# EAGLE design VierGewinnt010 (EAGLE 7.5.0)
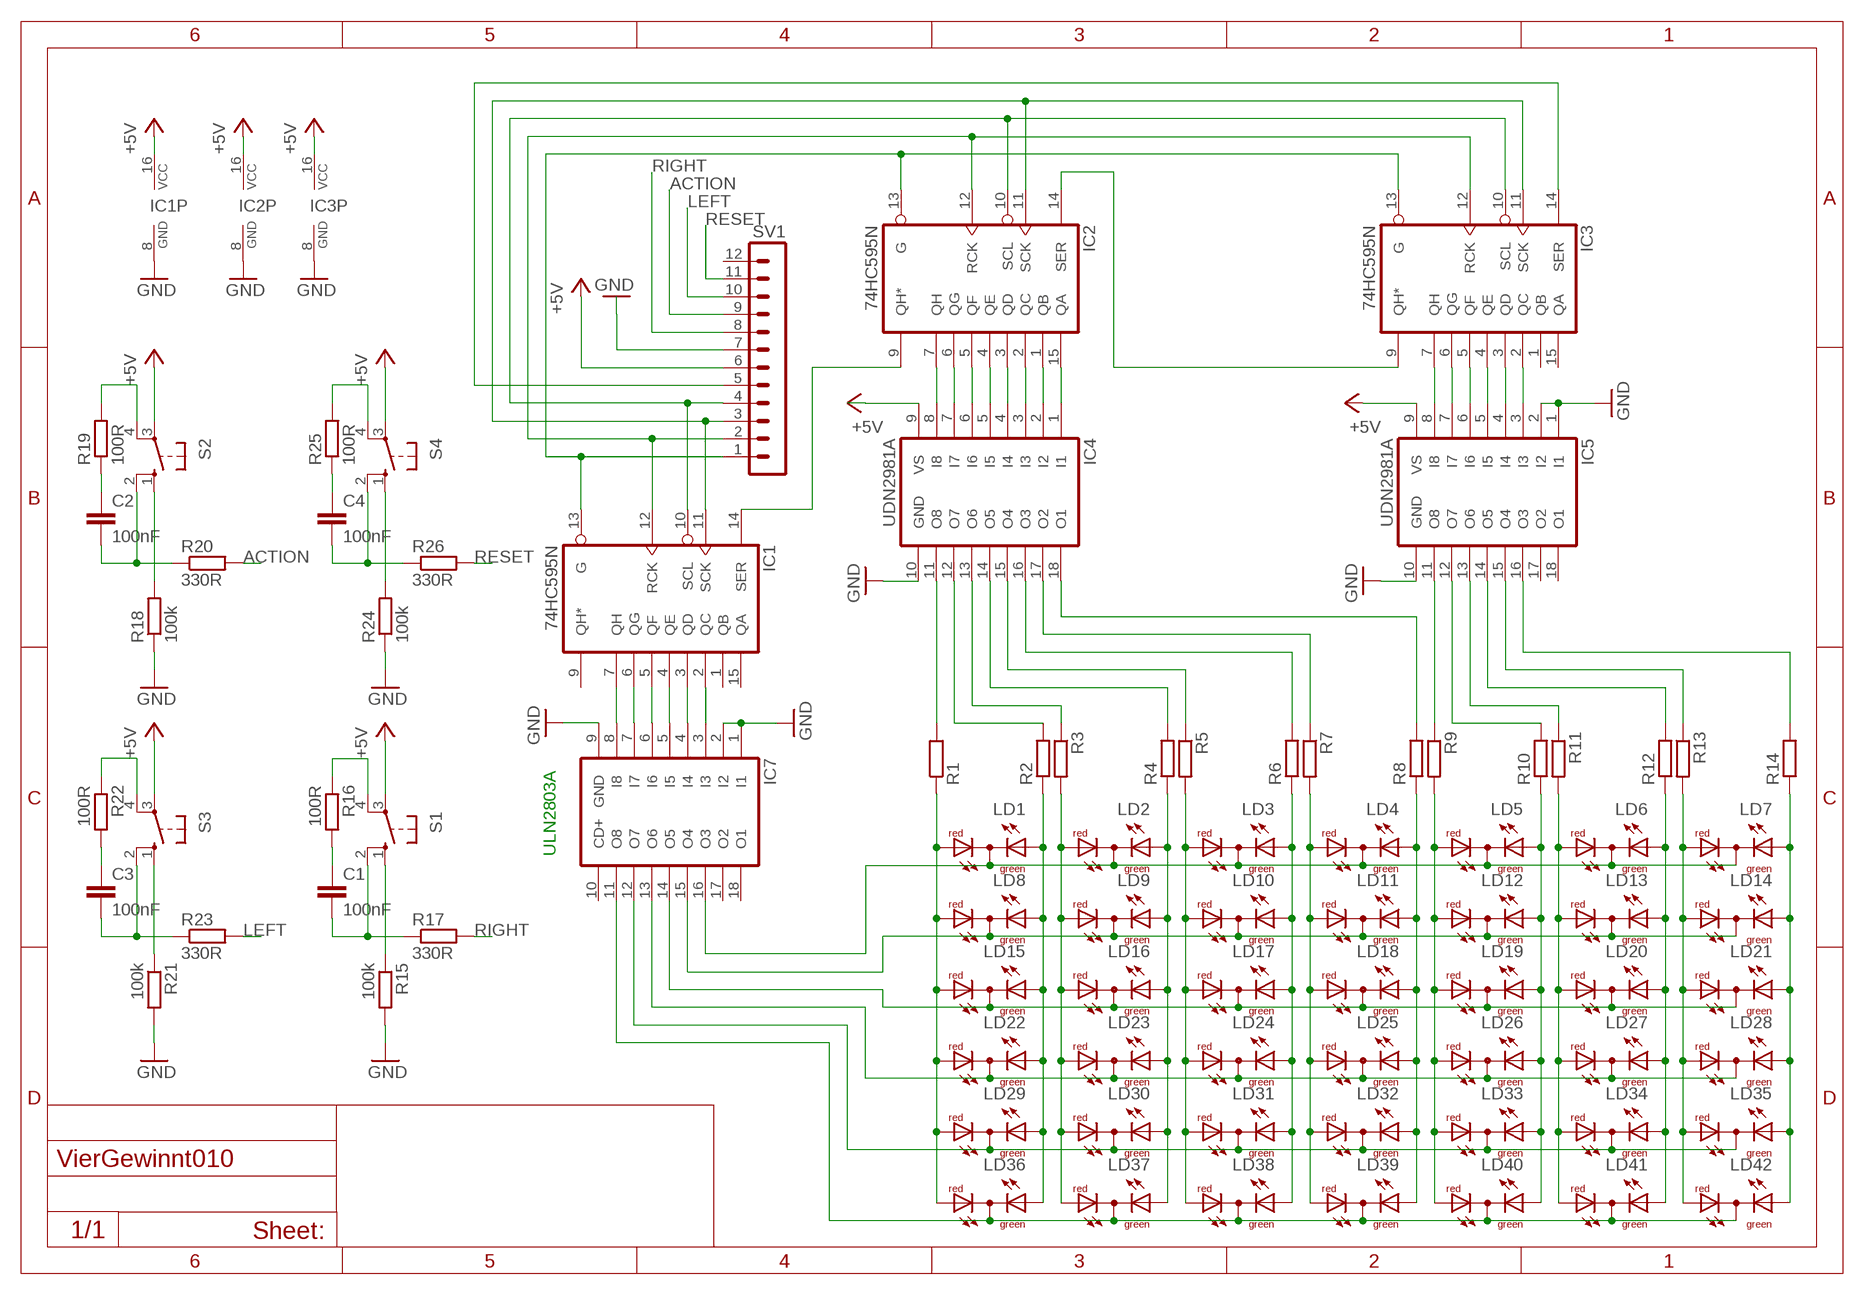
[diagram p0: schematic, sheet 1]

## Parts
C1  100nF  C-EUC0805  [C0805]
C2  100nF  C-EUC0805  [C0805]
C3  100nF  C-EUC0805  [C0805]
C4  100nF  C-EUC0805  [C0805]
IC1  74HC595N  [DIL16]
IC2  74HC595N  [DIL16]
IC3  74HC595N  [DIL16]
IC4  UDN2981A  [DIL18]
IC5  UDN2981A  [DIL18]
IC7  ULN2803A  [DIL18]
LD1  DUOLED-RG-C  [DUOLED-C-5MM]
LD2  DUOLED-RG-C  [DUOLED-C-5MM]
LD3  DUOLED-RG-C  [DUOLED-C-5MM]
LD4  DUOLED-RG-C  [DUOLED-C-5MM]
LD5  DUOLED-RG-C  [DUOLED-C-5MM]
LD6  DUOLED-RG-C  [DUOLED-C-5MM]
LD7  DUOLED-RG-C  [DUOLED-C-5MM]
LD8  DUOLED-RG-C  [DUOLED-C-5MM]
LD9  DUOLED-RG-C  [DUOLED-C-5MM]
LD10  DUOLED-RG-C  [DUOLED-C-5MM]
LD11  DUOLED-RG-C  [DUOLED-C-5MM]
LD12  DUOLED-RG-C  [DUOLED-C-5MM]
LD13  DUOLED-RG-C  [DUOLED-C-5MM]
LD14  DUOLED-RG-C  [DUOLED-C-5MM]
LD15  DUOLED-RG-C  [DUOLED-C-5MM]
LD16  DUOLED-RG-C  [DUOLED-C-5MM]
LD17  DUOLED-RG-C  [DUOLED-C-5MM]
LD18  DUOLED-RG-C  [DUOLED-C-5MM]
LD19  DUOLED-RG-C  [DUOLED-C-5MM]
LD20  DUOLED-RG-C  [DUOLED-C-5MM]
LD21  DUOLED-RG-C  [DUOLED-C-5MM]
LD22  DUOLED-RG-C  [DUOLED-C-5MM]
LD23  DUOLED-RG-C  [DUOLED-C-5MM]
LD24  DUOLED-RG-C  [DUOLED-C-5MM]
LD25  DUOLED-RG-C  [DUOLED-C-5MM]
LD26  DUOLED-RG-C  [DUOLED-C-5MM]
LD27  DUOLED-RG-C  [DUOLED-C-5MM]
LD28  DUOLED-RG-C  [DUOLED-C-5MM]
LD29  DUOLED-RG-C  [DUOLED-C-5MM]
LD30  DUOLED-RG-C  [DUOLED-C-5MM]
LD31  DUOLED-RG-C  [DUOLED-C-5MM]
LD32  DUOLED-RG-C  [DUOLED-C-5MM]
LD33  DUOLED-RG-C  [DUOLED-C-5MM]
LD34  DUOLED-RG-C  [DUOLED-C-5MM]
LD35  DUOLED-RG-C  [DUOLED-C-5MM]
LD36  DUOLED-RG-C  [DUOLED-C-5MM]
LD37  DUOLED-RG-C  [DUOLED-C-5MM]
LD38  DUOLED-RG-C  [DUOLED-C-5MM]
LD39  DUOLED-RG-C  [DUOLED-C-5MM]
LD40  DUOLED-RG-C  [DUOLED-C-5MM]
LD41  DUOLED-RG-C  [DUOLED-C-5MM]
LD42  DUOLED-RG-C  [DUOLED-C-5MM]
R1  R-EU_0207/10  [0207/10]
R2  R-EU_0207/10  [0207/10]
R3  R-EU_0207/10  [0207/10]
R4  R-EU_0207/10  [0207/10]
R5  R-EU_0207/10  [0207/10]
R6  R-EU_0207/10  [0207/10]
R7  R-EU_0207/10  [0207/10]
R8  R-EU_0207/10  [0207/10]
R9  R-EU_0207/10  [0207/10]
R10  R-EU_0207/10  [0207/10]
R11  R-EU_0207/10  [0207/10]
R12  R-EU_0207/10  [0207/10]
R13  R-EU_0207/10  [0207/10]
R14  R-EU_0207/10  [0207/10]
R15  100k  R-EU_R0603  [R0603]
R16  100R  R-EU_R0603  [R0603]
R17  330R  R-EU_R0603  [R0603]
R18  100k  R-EU_R0603  [R0603]
R19  100R  R-EU_R0603  [R0603]
R20  330R  R-EU_R0603  [R0603]
R21  100k  R-EU_R0603  [R0603]
R22  100R  R-EU_R0603  [R0603]
R23  330R  R-EU_R0603  [R0603]
R24  100k  R-EU_R0603  [R0603]
R25  100R  R-EU_R0603  [R0603]
R26  330R  R-EU_R0603  [R0603]
S1  10-XX  [B3F-10XX]
S2  10-XX  [B3F-10XX]
S3  10-XX  [B3F-10XX]
S4  10-XX  [B3F-10XX]
SV1  MA12-1  [MA12-1]

## Nets
+5V: IC1.16(VCC) IC2.16(VCC) IC3.16(VCC) IC4.9(VS) IC5.9(VS) S1.3(P) S2.3(P) S3.3(P) S4.3(P) SV1.6
ACTION: R20.2 SV1.9
GND: IC1.8(GND) IC2.8(GND) IC3.8(GND) IC4.10(GND) IC5.1(I1) IC5.2(I2) IC5.10(GND) IC7.1(I1) IC7.2(I2) IC7.9(GND) R15.2 R18.1 R21.2 R24.1 SV1.7
LEFT: R23.2 SV1.10
N$1: LD1.AR LD8.AR LD15.AR LD22.AR LD29.AR LD36.AR R1.1
N$2: LD1.AX(AG) LD8.AX(AG) LD15.AX(AG) LD22.AX(AG) LD29.AX(AG) LD36.AX(AG) R2.1
N$3: LD2.AR LD9.AR LD16.AR LD23.AR LD30.AR LD37.AR R3.2
N$4: LD2.AX(AG) LD9.AX(AG) LD16.AX(AG) LD23.AX(AG) LD30.AX(AG) LD37.AX(AG) R4.1
N$5: LD3.AR LD10.AR LD17.AR LD24.AR LD31.AR LD38.AR R5.2
N$6: LD3.AX(AG) LD10.AX(AG) LD17.AX(AG) LD24.AX(AG) LD31.AX(AG) LD38.AX(AG) R6.1
N$7: LD4.AR LD11.AR LD18.AR LD25.AR LD32.AR LD39.AR R7.2
N$8: LD4.AX(AG) LD11.AX(AG) LD18.AX(AG) LD25.AX(AG) LD32.AX(AG) LD39.AX(AG) R8.1
N$9: LD5.AR LD12.AR LD19.AR LD26.AR LD33.AR LD40.AR R9.2
N$10: LD5.AX(AG) LD12.AX(AG) LD19.AX(AG) LD26.AX(AG) LD33.AX(AG) LD40.AX(AG) R10.1
N$11: LD6.AR LD13.AR LD20.AR LD27.AR LD34.AR LD41.AR R11.2
N$12: LD6.AX(AG) LD13.AX(AG) LD20.AX(AG) LD27.AX(AG) LD34.AX(AG) LD41.AX(AG) R12.1
N$13: LD7.AR LD14.AR LD21.AR LD28.AR LD35.AR LD42.AR R13.2
N$14: LD7.AX(AG) LD14.AX(AG) LD21.AX(AG) LD28.AX(AG) LD35.AX(AG) LD42.AX(AG) R14.1
N$15: IC7.16(O3) LD1.C LD2.C LD3.C LD4.C LD5.C LD6.C LD7.C
N$17: IC7.14(O5) LD15.C LD16.C LD17.C LD18.C LD19.C LD20.C LD21.C
N$18: IC7.13(O6) LD22.C LD23.C LD24.C LD25.C LD26.C LD27.C LD28.C
N$19: IC7.12(O7) LD29.C LD30.C LD31.C LD32.C LD33.C LD34.C LD35.C
N$20: IC7.11(O8) LD36.C LD37.C LD38.C LD39.C LD40.C LD41.C LD42.C
N$21: IC4.11(O8) R1.2
N$22: IC4.12(O7) R2.2
N$23: IC4.13(O6) R3.1
N$24: IC4.14(O5) R4.2
N$25: IC4.15(O4) R5.1
N$26: IC4.16(O3) R6.2
N$27: IC4.17(O2) R7.1
N$28: IC4.18(O1) R8.2
N$29: IC5.11(O8) R9.1
N$30: IC5.12(O7) R10.2
N$31: IC5.13(O6) R11.1
N$32: IC5.14(O5) R12.2
N$33: IC5.15(O4) R13.1
N$34: IC5.16(O3) R14.2
N$35: IC2.1(QB) IC4.2(I2)
N$36: IC2.2(QC) IC4.3(I3)
N$37: IC2.3(QD) IC4.4(I4)
N$38: IC2.4(QE) IC4.5(I5)
N$39: IC2.5(QF) IC4.6(I6)
N$40: IC2.6(QG) IC4.7(I7)
N$41: IC2.7(QH) IC4.8(I8)
N$42: IC2.15(QA) IC4.1(I1)
N$43: R22.1 S3.4(P1)
N$44: IC3.2(QC) IC5.3(I3)
N$45: IC3.3(QD) IC5.4(I4)
N$46: IC3.4(QE) IC5.5(I5)
N$47: IC3.5(QF) IC5.6(I6)
N$48: IC3.6(QG) IC5.7(I7)
N$49: IC3.7(QH) IC5.8(I8)
N$50: C1.1 R16.2
N$51: IC2.14(SER) IC3.9(QH*)
N$52: IC1.14(SER) IC2.9(QH*)
N$53: IC1.13(G) IC2.13(G) IC3.13(G) SV1.1
N$54: IC1.12(RCK) IC2.12(RCK) IC3.12(RCK) SV1.2
N$55: IC1.10(SCL) IC2.10(SCL) IC3.10(SCL) SV1.4
N$56: IC1.11(SCK) IC2.11(SCK) IC3.11(SCK) SV1.3
N$57: IC3.14(SER) SV1.5
N$58: R18.2 S2.1(S)
N$59: R19.2 S2.4(P1)
N$60: C1.2 R17.1 S1.2(S1)
N$61: R16.1 S1.4(P1)
N$62: C3.2 R23.1 S3.2(S1)
N$63: C2.2 R20.1 S2.2(S1)
N$64: R21.1 S3.1(S)
N$65: R15.1 S1.1(S)
N$66: C4.1 R25.1
N$67: R25.2 S4.4(P1)
N$68: C2.1 R19.1
N$69: C4.2 R26.1 S4.2(S1)
N$70: C3.1 R22.2
N$71: R24.2 S4.1(S)
N$74: IC1.2(QC) IC7.3(I3)
N$75: IC1.3(QD) IC7.4(I4)
N$76: IC1.4(QE) IC7.5(I5)
N$77: IC1.5(QF) IC7.6(I6)
N$78: IC1.6(QG) IC7.7(I7)
N$79: IC1.7(QH) IC7.8(I8)
N$80: IC7.15(O4) LD8.C LD9.C LD10.C LD11.C LD12.C LD13.C LD14.C
RESET: R26.2 SV1.11
RIGHT: R17.2 SV1.8
Unconnected: IC1.1(QB) IC1.9(QH*) IC1.15(QA) IC3.1(QB) IC3.15(QA) IC5.17(O2) IC5.18(O1) IC7.10(CD+) IC7.17(O2) IC7.18(O1) SV1.12

## Notes on the sheet
- ULN2803A

## Library data of the parts
C1-C4 = rcl:C-EU: CAPACITOR, European symbol
IC1-IC3 = 74xx-eu:74*595: 8-bit SHIFT REGISTER, output latch
IC4 IC5 = uln-udn:UDN298*: DRIVER ARRAY Source: Allegro Microsystems Inc. / UDN2981-UDN2984.pdf
IC7 = uln-udn:ULN2803A: DRIVER ARRAY
LD1-LD42 = led:DUOLED-RG-C: DUO LED 2 colors (red/green), 5 mm, round, common Cathode www.ligitek.com or other producers.
R1-R26 = rcl:R-EU_: RESISTOR, European symbol
S1-S4 = switch-omron:10-XX: OMRON SWITCH
SV1 = con-lstb:MA12-1: PIN HEADER

## Board
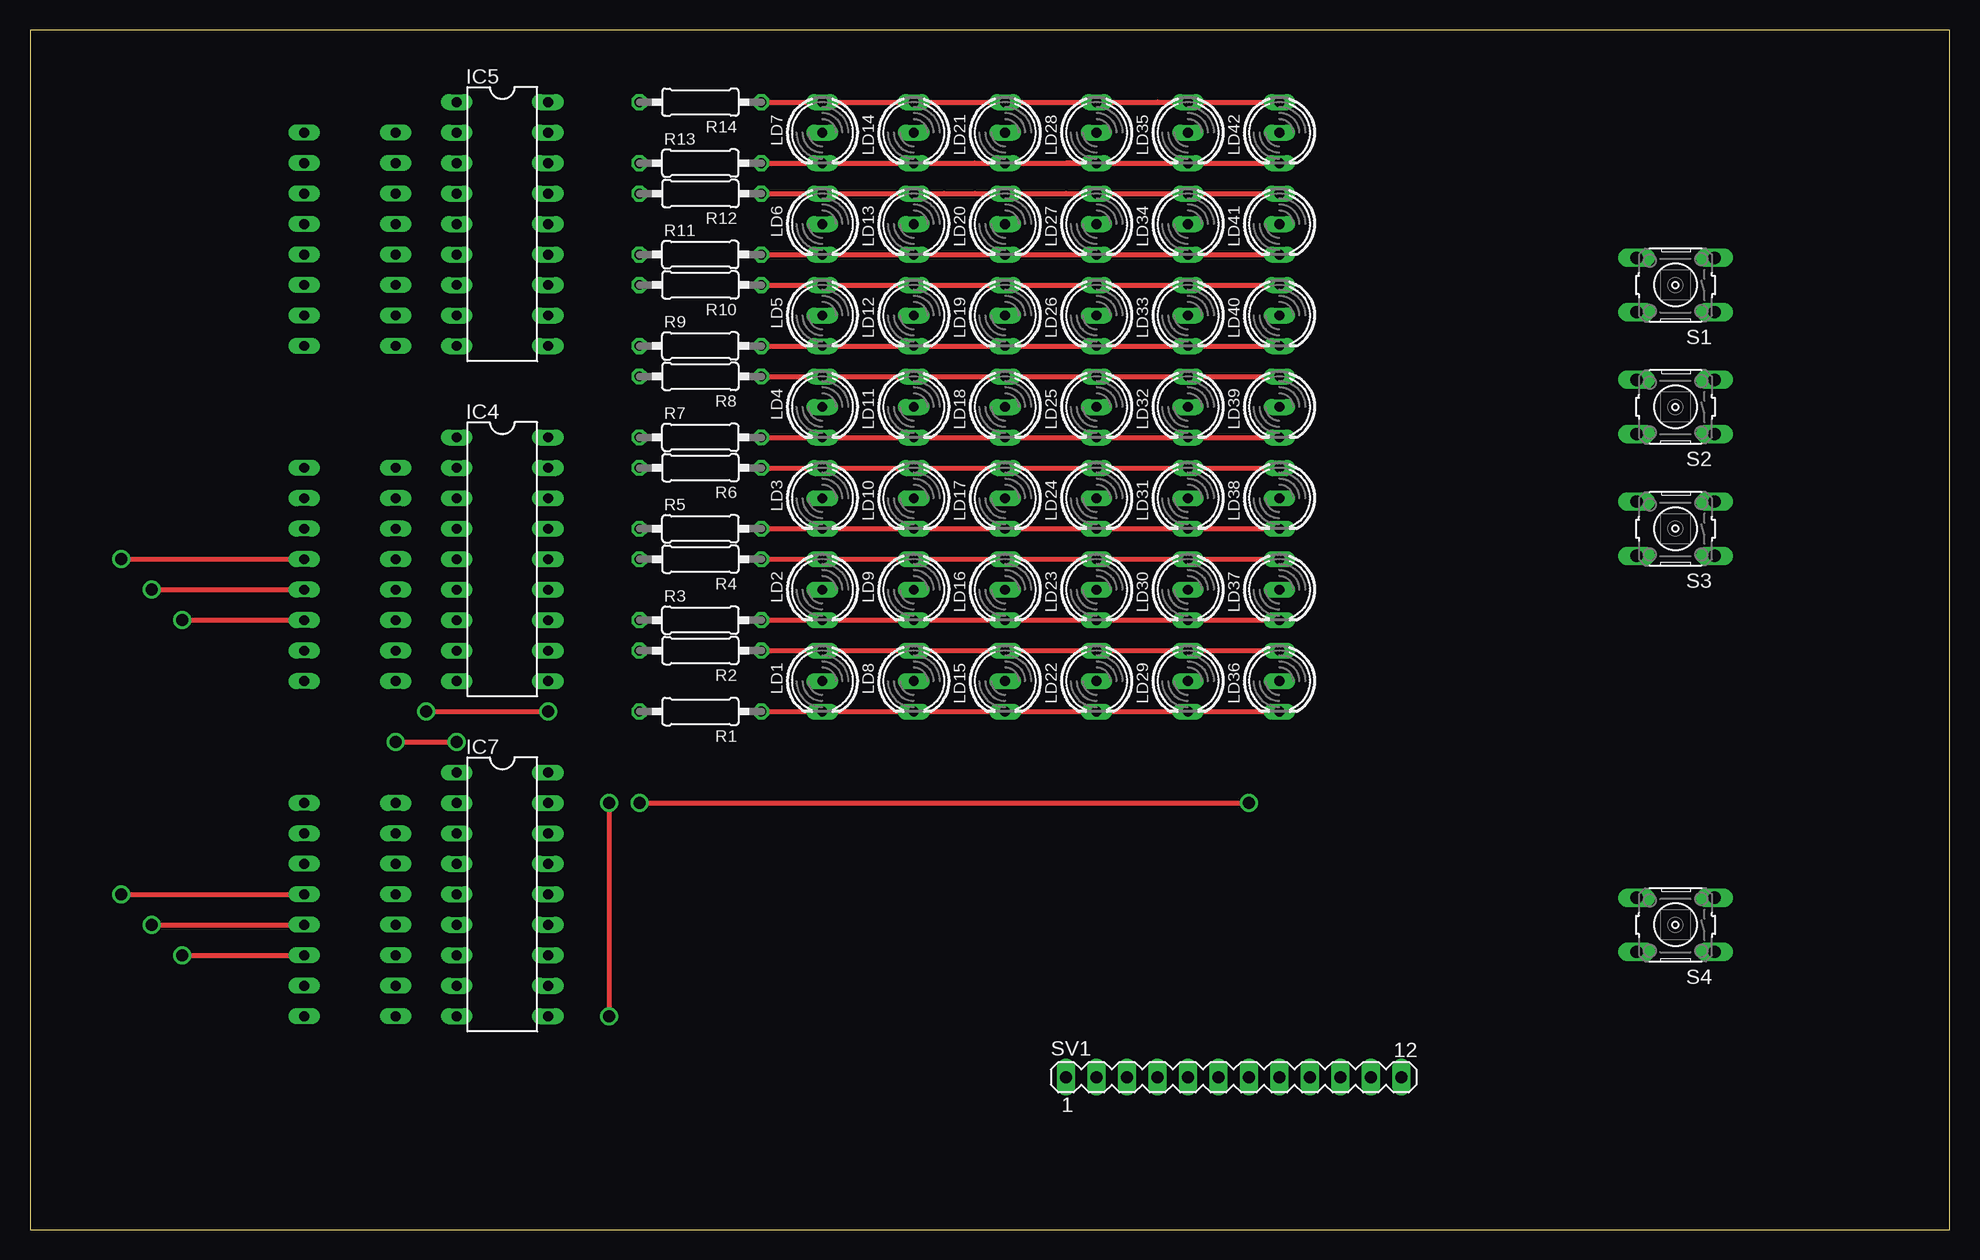
[diagram p1: board, top side]
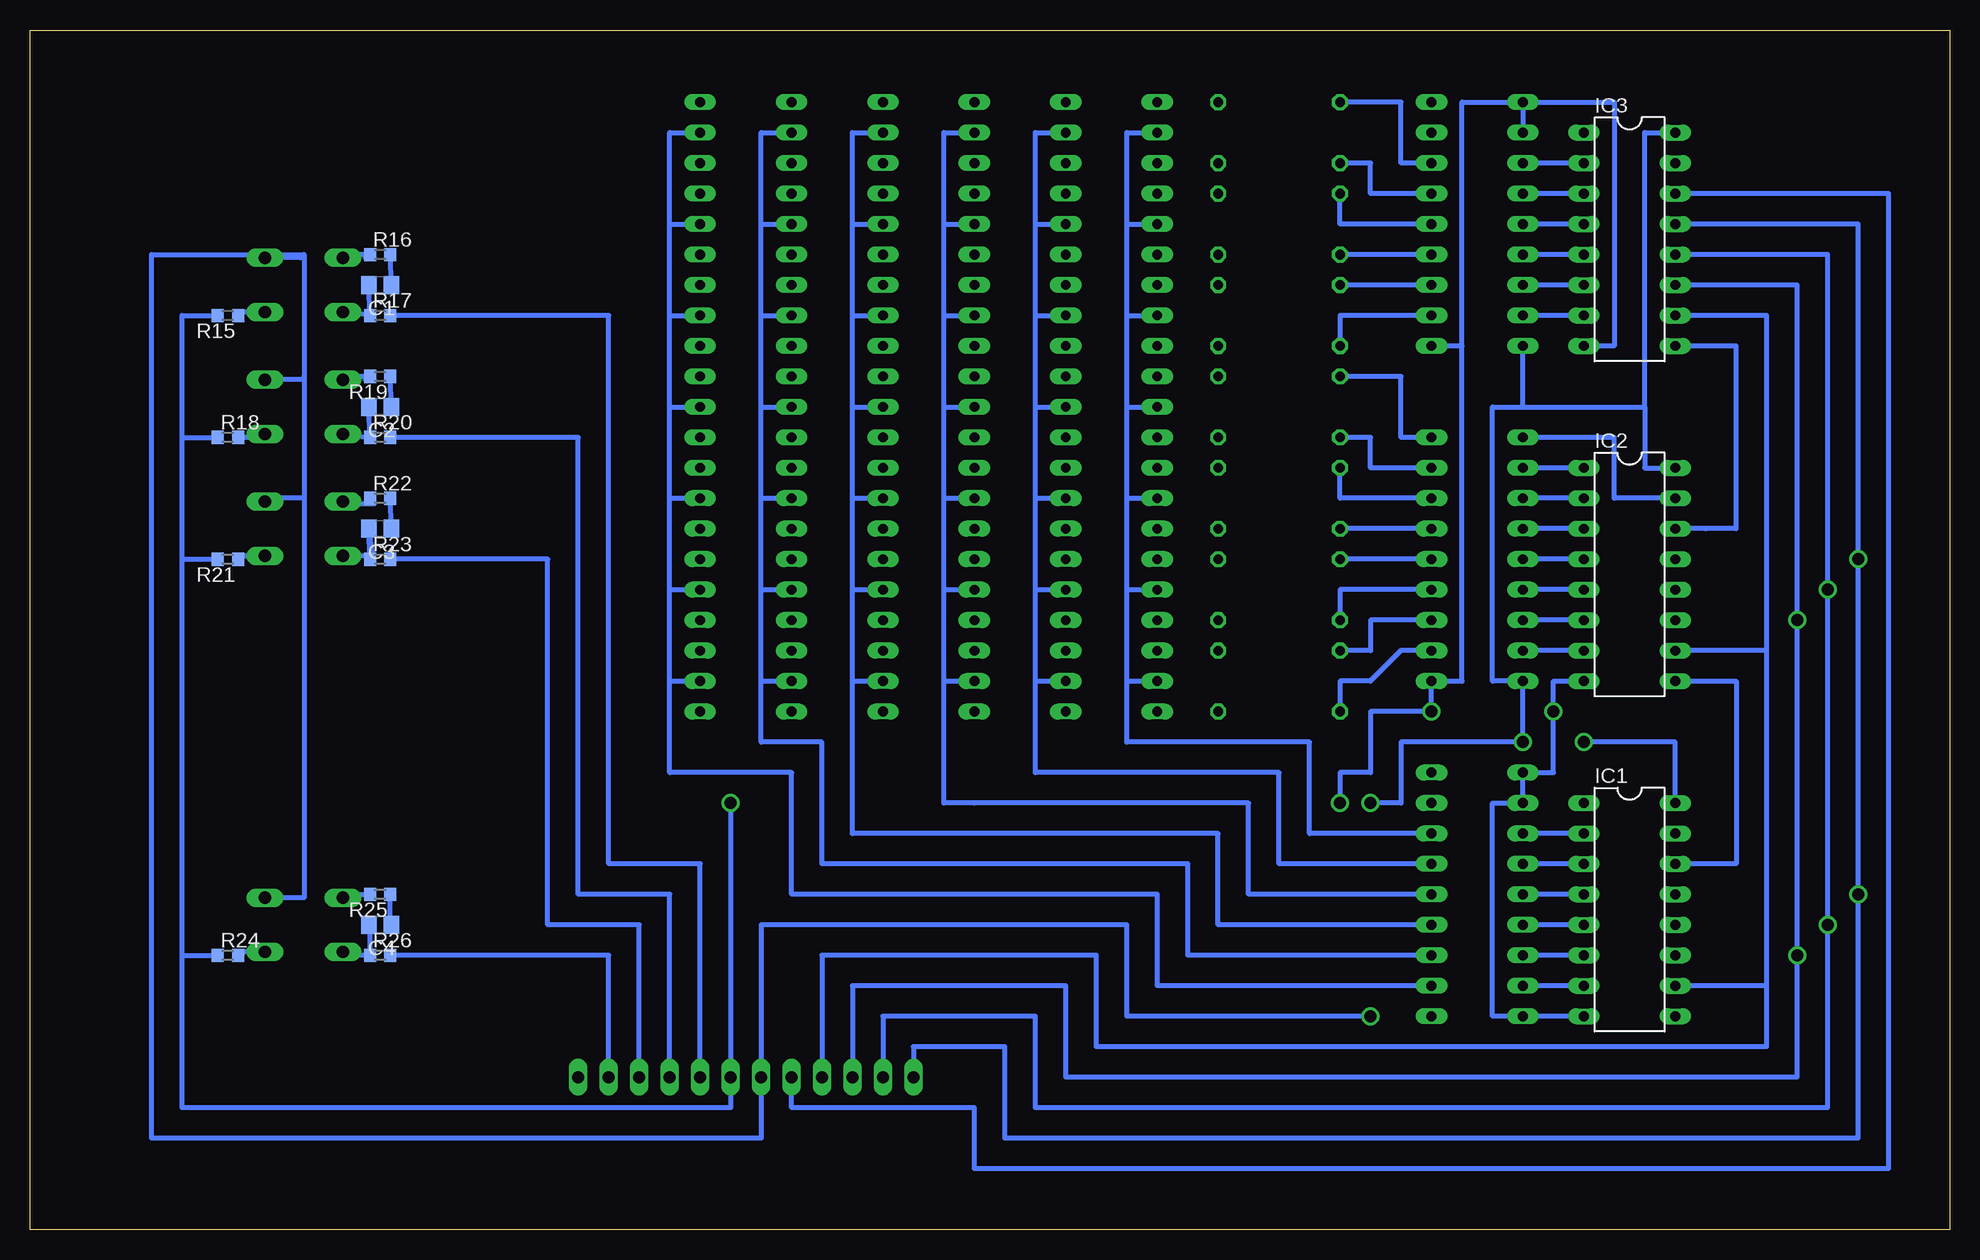
[diagram p2: board, bottom side, seen from below]

Size 160 x 100 mm. Coordinates in mm from the lower left corner, seen from the top.
Outline: 0,0 160,0 160,100 0,100 0,0
Copper layers (1*16): Top 0.035mm / dielectric 1.5mm / Bottom 0.035mm
Design rules "default": minimum track width 10mil, minimum drill 24mil, track to track 8mil, track to pad 8mil, pad to pad 8mil, via to via 8mil, smd to smd 8mil, copper to edge 40mil, drill to drill 8mil, minimum pad ring 10mil, minimum via ring 8mil, stop-mask expansion 4mil, vias tented up to drill 0mil, thermal gap 10mil

### Footprints (pad centres in the part's own frame; a part is rotated, then mirrored left to right if it is on the bottom)
C0805 = smd 1.3 x 1.5: 1 -0.95,0; 2 0.95,0
DIL16 = drill 0.813 long: 1 -8.89,-3.81; 2 -6.35,-3.81; 3 -3.81,-3.81; 4 -1.27,-3.81; 5 1.27,-3.81; 6 3.81,-3.81; 7 6.35,-3.81; 8 8.89,-3.81; 9 8.89,3.81; 10 6.35,3.81; 11 3.81,3.81; 12 1.27,3.81; 13 -1.27,3.81; 14 -3.81,3.81; 15 -6.35,3.81; 16 -8.89,3.81
DIL18 = drill 0.813 long: 1 -10.16,-3.81; 2 -7.62,-3.81; 3 -5.08,-3.81; 4 -2.54,-3.81; 5 0,-3.81; 6 2.54,-3.81; 7 5.08,-3.81; 8 7.62,-3.81; 9 10.16,-3.81; 10 10.16,3.81; 11 7.62,3.81; 12 5.08,3.81; 13 2.54,3.81; 14 0,3.81; 15 -2.54,3.81; 16 -5.08,3.81; 17 -7.62,3.81; 18 -10.16,3.81
DUOLED-C-5MM = drill 0.813 long: AR 2.54,0; AX -2.54,0; C 0,0
0207/10 = drill 0.813 octagon: 1 -5.08,0; 2 5.08,0
R0603 = smd 1 x 1.1: 1 -0.85,0; 2 0.85,0
B3F-10XX = drill 1.016 long: 1 -3.251,2.261; 2 3.251,2.261; 3 -3.251,-2.261; 4 3.251,-2.261
MA12-1 = drill 1.016 long: 1 -13.97,0; 2 -11.43,0; 3 -8.89,0; 4 -6.35,0; 5 -3.81,0; 6 -1.27,0; 7 1.27,0; 8 3.81,0; 9 6.35,0; 10 8.89,0; 11 11.43,0; 12 13.97,0

### Placement (x,y rotation side)
C1  130.81,78.74 180 bottom
C2  130.81,68.58 180 bottom
C3  130.81,58.42 180 bottom
C4  130.81,25.4 180 bottom
IC1  26.67,26.67 270 bottom
IC2  26.67,54.61 270 bottom
IC3  26.67,82.55 270 bottom
IC4  39.37,55.88 270 top
IC5  39.37,83.82 270 top
IC7  39.37,27.94 270 top
LD1  66.04,45.72 270 top
LD2  66.04,53.34 270 top
LD3  66.04,60.96 270 top
LD4  66.04,68.58 270 top
LD5  66.04,76.2 270 top
LD6  66.04,83.82 270 top
LD7  66.04,91.44 270 top
LD8  73.66,45.72 270 top
LD9  73.66,53.34 270 top
LD10  73.66,60.96 270 top
LD11  73.66,68.58 270 top
LD12  73.66,76.2 270 top
LD13  73.66,83.82 270 top
LD14  73.66,91.44 270 top
LD15  81.28,45.72 270 top
LD16  81.28,53.34 270 top
LD17  81.28,60.96 270 top
LD18  81.28,68.58 270 top
LD19  81.28,76.2 270 top
LD20  81.28,83.82 270 top
LD21  81.28,91.44 270 top
LD22  88.9,45.72 270 top
LD23  88.9,53.34 270 top
LD24  88.9,60.96 270 top
LD25  88.9,68.58 270 top
LD26  88.9,76.2 270 top
LD27  88.9,83.82 270 top
LD28  88.9,91.44 270 top
LD29  96.52,45.72 270 top
LD30  96.52,53.34 270 top
LD31  96.52,60.96 270 top
LD32  96.52,68.58 270 top
LD33  96.52,76.2 270 top
LD34  96.52,83.82 270 top
LD35  96.52,91.44 270 top
LD36  104.14,45.72 270 top
LD37  104.14,53.34 270 top
LD38  104.14,60.96 270 top
LD39  104.14,68.58 270 top
LD40  104.14,76.2 270 top
LD41  104.14,83.82 270 top
LD42  104.14,91.44 270 top
R1  55.88,43.18 180 top
R2  55.88,48.26 180 top
R3  55.88,50.8 0 top
R4  55.88,55.88 180 top
R5  55.88,58.42 0 top
R6  55.88,63.5 180 top
R7  55.88,66.04 0 top
R8  55.88,71.12 180 top
R9  55.88,73.66 0 top
R10  55.88,78.74 180 top
R11  55.88,81.28 0 top
R12  55.88,86.36 180 top
R13  55.88,88.9 0 top
R14  55.88,93.98 180 top
R15  143.51,76.2 180 bottom
R16  130.81,81.28 0 bottom
R17  130.81,76.2 0 bottom
R18  143.51,66.04 0 bottom
R19  130.81,71.12 180 bottom
R20  130.81,66.04 0 bottom
R21  143.51,55.88 180 bottom
R22  130.81,60.96 0 bottom
R23  130.81,55.88 0 bottom
R24  143.51,22.86 0 bottom
R25  130.81,27.94 180 bottom
R26  130.81,22.86 0 bottom
S1  137.16,78.74 180 top
S2  137.16,68.58 180 top
S3  137.16,58.42 180 top
S4  137.16,25.4 180 top
SV1  100.33,12.7 0 top

### Tracks (layer width: path | path; a pad name or v marks a point on that pad's centre or on a via)
+5V  (via drill 1)
  Top 0.406: v30.48,40.64 v35.56,40.64 | v48.26,35.56 v48.26,17.78
  Bottom 0.406: 140.13,60.96 S3.3 | 137.16,60.96 140.13,60.96 | 137.16,81.28 137.44,81 S1.3 | 137.16,81.28 137.16,71.12 | 137.16,71.12 137.16,60.96 | 137.16,81.28 149.86,81.28 149.86,7.62 99.06,7.62 SV1.6 99.06,25.4 68.58,25.4 68.58,17.78 v48.26,17.78 | S4.3 137.16,27.66 137.16,60.96 | 137.16,60.96 140.13,60.96 | 137.16,71.12 137.16,60.96 | 137.16,71.12 137.16,70.84 S2.3 | 35.56,68.58 IC5.9 | IC2.16 25.4,63.5 25.4,68.58 | 35.56,68.58 25.4,68.58 | IC3.16 25.4,91.44 25.4,68.58 | v48.26,35.56 45.72,35.56 45.72,40.64 v35.56,40.64 IC4.9 38.1,45.72 38.1,68.58 35.56,68.58 | IC1.16 22.86,40.64 v30.48,40.64
ACTION
  Bottom 0.406: R20.2 114.3,66.04 114.3,27.94 106.68,27.94 SV1.9
GND  (via drill 1)
  Top 0.406: v33.02,43.18 v43.18,43.18 | v50.8,35.56 v101.6,35.56
  Bottom 0.406: IC5.1 IC5.2 | 147.32,66.04 147.32,76.2 R15.2 | 147.32,55.88 147.32,66.04 | 147.32,66.04 R18.1 | 147.32,55.88 R21.2 | 147.32,22.86 147.32,10.16 101.6,10.16 SV1.7 v101.6,35.56 | 147.32,22.86 147.32,55.88 | 147.32,22.86 R24.1 | IC2.8 33.02,45.72 v33.02,43.18 33.02,38.1 IC7.1 IC7.2 38.1,35.56 38.1,17.78 IC7.9 IC1.8 | IC5.1 27.94,93.98 | 27.94,93.98 27.94,73.66 | 27.94,73.66 IC3.8 27.94,73.66 | v50.8,35.56 50.8,38.1 48.26,38.1 48.26,43.18 v43.18,43.18 IC4.10 40.64,45.72 40.64,73.66 | 40.64,93.98 IC5.1 | 40.64,73.66 40.64,93.98 | 40.64,73.66 IC5.10 | 27.94,93.98 27.94,73.66 | 40.64,93.98 27.94,93.98 | 40.64,73.66 40.64,93.98
LEFT
  Bottom 0.406: R23.2 116.84,55.88 116.84,25.4 109.22,25.4 SV1.10
N$1
  Top 0.406: R1.1 LD1.AR 71.12,43.18 LD8.AR LD15.AR LD22.AR LD29.AR LD36.AR
N$2
  Top 0.406: R2.1 LD1.AX LD8.AX LD15.AX LD22.AX LD29.AX LD36.AX
N$3
  Top 0.406: R3.2 LD2.AR LD9.AR LD16.AR LD23.AR LD30.AR LD37.AR
N$4
  Top 0.406: R4.1 LD2.AX LD9.AX LD16.AX LD23.AX LD30.AX LD37.AX
N$5
  Top 0.406: R5.2 LD3.AR LD10.AR LD17.AR LD24.AR LD31.AR LD38.AR
N$6
  Top 0.406: R6.1 LD3.AX LD10.AX LD17.AX LD24.AX LD31.AX LD38.AX
N$7
  Top 0.406: R7.2 LD4.AR LD11.AR LD18.AR LD25.AR LD32.AR LD39.AR
N$8
  Top 0.406: R8.1 LD4.AX LD11.AX LD18.AX LD25.AX LD32.AX LD39.AX
N$9
  Top 0.406: R9.2 LD5.AR LD12.AR LD19.AR LD26.AR LD33.AR LD40.AR
N$10
  Top 0.406: R10.1 LD5.AX LD12.AX LD19.AX LD26.AX LD33.AX LD40.AX
N$11
  Top 0.406: R11.2 LD6.AR LD13.AR LD20.AR LD27.AR LD34.AR LD41.AR
N$12
  Top 0.406: R12.1 LD6.AX LD13.AX | LD13.AX 76.2,86.36 | 76.2,86.36 78.74,86.36 LD20.AX 86.36,86.36 LD27.AX LD34.AX LD41.AX | LD13.AX 76.2,86.36
N$13
  Top 0.406: R13.2 LD7.AR LD14.AR | LD14.AR 78.74,88.9 LD21.AR | LD28.AR 86.36,88.9 | LD21.AR LD28.AR | LD28.AR LD35.AR | LD35.AR LD42.AR LD35.AR | LD14.AR LD21.AR
N$14
  Top 0.406: R14.1 LD7.AX LD14.AX LD21.AX LD28.AX 93.98,93.98 LD35.AX LD42.AX
N$15
  Bottom 0.406: LD7.C 68.58,91.44 68.58,83.82 | 68.58,83.82 LD6.C 68.58,83.82 | 68.58,76.2 68.58,83.82 | 68.58,76.2 LD5.C 68.58,76.2 | 68.58,68.58 68.58,76.2 | 68.58,68.58 LD4.C 68.58,68.58 | 68.58,60.96 68.58,68.58 | 68.58,60.96 LD3.C 68.58,60.96 | 68.58,53.34 68.58,60.96 | 68.58,53.34 LD2.C 68.58,53.34 | 68.58,45.72 68.58,53.34 | 68.58,45.72 LD1.C 68.58,45.72 | 68.58,45.72 68.58,40.64 53.34,40.64 53.34,33.02 IC7.16
N$16  (via drill 1)
  other vias: 12.7,22.86
N$17
  Bottom 0.406: LD21.C 83.82,91.44 83.82,83.82 | 83.82,83.82 LD20.C 83.82,83.82 | 83.82,76.2 83.82,83.82 | 83.82,76.2 LD19.C 83.82,76.2 | 83.82,68.58 83.82,76.2 | 83.82,68.58 LD18.C 83.82,68.58 | 83.82,60.96 83.82,68.58 | 83.82,60.96 LD17.C 83.82,60.96 | 83.82,53.34 83.82,60.96 | 83.82,53.34 LD16.C 83.82,53.34 | 83.82,45.72 83.82,53.34 | 83.82,45.72 LD15.C 83.82,45.72 | 83.82,45.72 83.82,35.56 81.28,35.56 58.42,35.56 58.42,27.94 IC7.14
N$18
  Bottom 0.406: LD28.C 91.44,91.44 91.44,83.82 | 91.44,83.82 LD27.C 91.44,83.82 | 91.44,76.2 91.44,83.82 | 91.44,76.2 LD26.C 91.44,76.2 | 91.44,68.58 91.44,76.2 | 91.44,68.58 LD25.C 91.44,68.58 | 91.44,60.96 91.44,68.58 | 91.44,60.96 LD24.C 91.44,60.96 | 91.44,53.34 91.44,60.96 | 91.44,53.34 LD23.C 91.44,53.34 | 91.44,45.72 91.44,53.34 | 91.44,45.72 LD22.C 91.44,45.72 | 91.44,45.72 91.44,33.02 60.96,33.02 60.96,25.4 IC7.13
N$19
  Bottom 0.406: LD35.C 99.06,91.44 99.06,83.82 | 99.06,83.82 LD34.C 99.06,83.82 | 99.06,76.2 99.06,83.82 | 99.06,76.2 LD33.C 99.06,76.2 | 99.06,68.58 99.06,76.2 | 99.06,68.58 LD32.C 99.06,68.58 | 99.06,60.96 99.06,68.58 | 99.06,60.96 LD31.C 99.06,60.96 | 99.06,53.34 99.06,60.96 | 99.06,53.34 LD30.C 99.06,53.34 | 99.06,45.72 99.06,53.34 | 99.06,45.72 LD29.C 99.06,45.72 | IC7.12 63.5,22.86 63.5,30.48 93.98,30.48 93.98,40.64 99.06,40.64 99.06,45.72
N$20
  Bottom 0.406: LD42.C 106.68,91.44 106.68,83.82 | 106.68,83.82 LD41.C 106.68,83.82 | 106.68,76.2 106.68,83.82 | 106.68,76.2 LD40.C 106.68,76.2 | 106.68,68.58 106.68,76.2 | 106.68,68.58 LD39.C 106.68,68.58 | 106.68,60.96 106.68,68.58 | 106.68,60.96 LD38.C 106.68,60.96 | 106.68,53.34 106.68,60.96 | 106.68,53.34 LD37.C 106.68,53.34 | 106.68,45.72 106.68,53.34 | 106.68,45.72 LD36.C 106.68,45.72 | IC7.11 66.04,20.32 66.04,27.94 96.52,27.94 96.52,38.1 106.68,38.1 106.68,45.72
N$21
  Bottom 0.406: IC4.11 45.72,48.26 48.26,45.72 | 48.26,45.72 50.8,45.72 | 48.26,45.72 50.8,45.72 | 50.8,45.72 R1.2
N$22
  Bottom 0.406: IC4.12 48.26,50.8 48.26,48.26 R2.2
N$23
  Bottom 0.406: IC4.13 50.8,53.34 R3.1
N$24
  Bottom 0.406: IC4.14 R4.2
N$25
  Bottom 0.406: IC4.15 R5.1
N$26
  Bottom 0.406: IC4.16 50.8,60.96 R6.2
N$27
  Bottom 0.406: IC4.17 48.26,63.5 48.26,66.04 R7.1
N$28
  Bottom 0.406: IC4.18 45.72,66.04 45.72,71.12 R8.2
N$29
  Bottom 0.406: R9.1 50.8,76.2 IC5.11
N$30
  Bottom 0.406: IC5.12 R10.2
N$31
  Bottom 0.406: IC5.13 R11.1
N$32
  Bottom 0.406: IC5.14 50.8,83.82 R12.2
N$33
  Bottom 0.406: IC5.15 48.26,86.36 48.26,88.9 R13.1
N$34
  Bottom 0.406: IC5.16 45.72,88.9 45.72,93.98 R14.2
N$35
  Bottom 0.406: IC2.1 IC4.2
N$36
  Bottom 0.406: IC2.2 IC4.3
N$37
  Bottom 0.406: IC2.3 IC4.4
N$38
  Bottom 0.406: IC2.4 IC4.5
N$39
  Bottom 0.406: IC2.5 IC4.6
N$40
  Bottom 0.406: IC2.6 IC4.7
N$41
  Bottom 0.406: IC2.7 IC4.8
N$42
  Bottom 0.406: IC2.15 27.94,60.96 27.94,66.04 IC4.1
N$43
  Bottom 0.406: R22.1 131.48,60.68 131.28,60.48 133.71,60.48 S3.4
N$44
  Bottom 0.406: IC3.2 IC5.3
N$45
  Bottom 0.406: IC3.3 IC5.4
N$46
  Bottom 0.406: IC3.4 IC5.5
N$47
  Bottom 0.406: IC3.5 IC5.6
N$48
  Bottom 0.406: IC3.6 IC5.7
N$49
  Bottom 0.406: IC3.7 IC5.8
N$50
  Bottom 0.406: C1.1 R16.2
N$51
  Bottom 0.406: IC3.9 20.32,73.66 17.78,73.66 17.78,58.42 20.32,58.42 IC2.14
N$52
  Bottom 0.406: IC2.9 17.78,45.72 17.78,30.48 IC1.14
N$53  (via drill 1)
  Top 0.406: v7.62,27.94 IC1.13 | v7.62,55.88 IC2.13
  Bottom 0.406: SV1.1 86.36,15.24 78.74,15.24 78.74,7.62 7.62,7.62 v7.62,27.94 v7.62,55.88 7.62,83.82 | 7.62,83.82 10.16,83.82 IC3.13 7.62,83.82
N$54  (via drill 1)
  Top 0.406: v10.16,25.4 IC1.12 | v10.16,53.34 IC2.12
  Bottom 0.406: SV1.2 88.9,17.78 76.2,17.78 76.2,10.16 10.16,10.16 v10.16,25.4 v10.16,53.34 10.16,81.28 IC3.12
N$55
  Bottom 0.406: 15.24,48.26 IC2.10 | 15.24,20.32 15.24,48.26 | 15.24,20.32 IC1.10 | IC3.10 15.24,76.2 15.24,48.26 | 15.24,20.32 15.24,15.24 48.26,15.24 71.12,15.24 71.12,22.86 93.98,22.86 SV1.4
N$56  (via drill 1)
  Top 0.406: v12.7,22.86 IC1.11 | v12.7,50.8 IC2.11
  Bottom 0.406: IC3.11 12.7,78.74 v12.7,50.8 v12.7,22.86 12.7,12.7 73.66,12.7 73.66,20.32 91.44,20.32 SV1.3
N$57
  Bottom 0.406: IC3.14 5.08,86.36 5.08,10.16 | SV1.5 96.52,10.16 81.28,10.16 | 5.08,5.08 5.08,10.16 | 5.08,5.08 81.28,5.08 | 81.28,5.08 81.28,10.16 | 81.28,5.08 81.28,10.16 | 81.28,5.08 81.28,10.16 | 5.08,5.08 5.08,10.16 | 5.08,5.08 5.08,10.16
N$58
  Bottom 0.406: S2.1 140.69,66.04 R18.2
N$59
  Bottom 0.406: 132.04,70.84 R19.2 133.63,71.12 S2.4
N$60
  Bottom 0.406: C1.2 R17.1 133.31,76.48 S1.2
N$61
  Bottom 0.406: 132.04,81 R16.1 133.63,81.28 S1.4
N$62
  Bottom 0.406: R23.1 C3.2 131.48,56.16 S3.2
N$63
  Bottom 0.406: C2.2 R20.1 132.08,66.04 S2.2
N$64
  Bottom 0.406: R21.1 142.28,56.16 S3.1
N$65
  Bottom 0.406: R15.1 142.28,76.48 S1.1
N$66
  Bottom 0.406: C4.1 129.96,25.4 R25.1
N$67
  Bottom 0.406: R25.2 133.91,27.94 S4.4
N$68
  Bottom 0.406: C2.1 R19.1
N$69
  Bottom 0.406: C4.2 131.66,25.4 R26.1 133.91,22.86 S4.2
N$70
  Bottom 0.406: C3.1 R22.2
N$71
  Bottom 0.406: S4.1 142.66,23.14 R24.2
N$74
  Bottom 0.406: IC1.2 IC7.3
N$75
  Bottom 0.406: IC1.3 IC7.4
N$76
  Bottom 0.406: IC1.4 IC7.5
N$77
  Bottom 0.406: IC1.5 IC7.6
N$78
  Bottom 0.406: IC1.6 IC7.7
N$79
  Bottom 0.406: IC1.7 IC7.8
N$80
  Bottom 0.406: LD14.C 76.2,91.44 76.2,83.82 | 76.2,83.82 LD13.C 76.2,83.82 | 76.2,76.2 76.2,83.82 | 76.2,76.2 LD12.C 76.2,76.2 | 76.2,68.58 76.2,76.2 | 76.2,68.58 LD11.C 76.2,68.58 | 76.2,60.96 76.2,68.58 | 76.2,60.96 LD10.C 76.2,60.96 | 76.2,53.34 76.2,60.96 | 76.2,53.34 LD9.C 76.2,53.34 | 76.2,45.72 76.2,53.34 | 76.2,45.72 LD8.C 76.2,45.72 | 76.2,45.72 76.2,38.1 55.88,38.1 55.88,30.48 IC7.15
RESET
  Bottom 0.406: R26.2 111.76,22.86 SV1.11
RIGHT
  Bottom 0.406: R17.2 111.76,76.2 111.76,30.48 104.14,30.48 SV1.8